# EAGLE design ir-sensorboard (EAGLE 5.11)
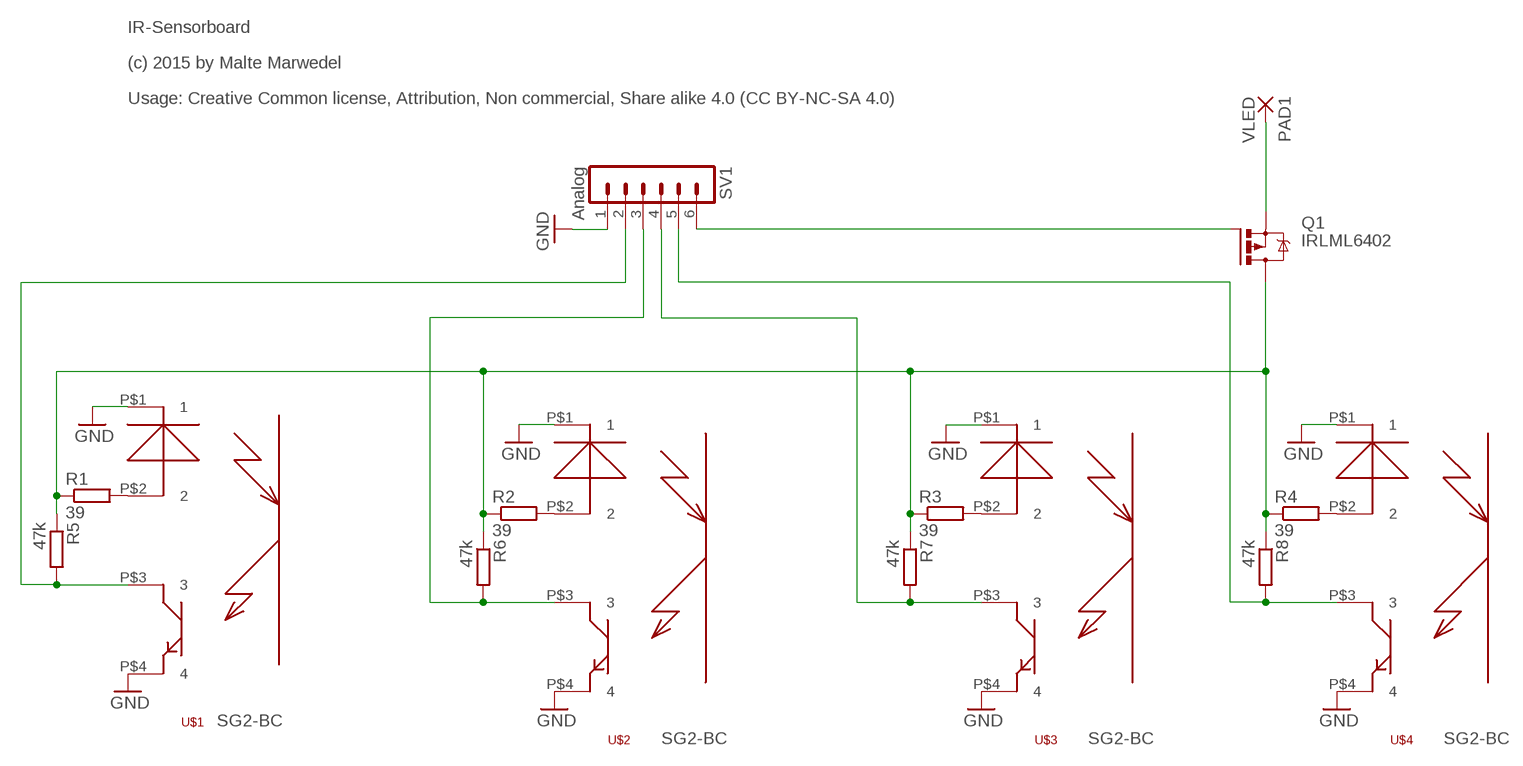
[diagram p0: schematic, sheet 1]

## Parts
PAD1  VLED  1,6/0,8  [1,6/0,8]
Q1  IRLML6402  IRLML5203  [MICRO3]
R1  39  R-EU_R0805  [R0805]
R2  39  R-EU_R0805  [R0805]
R3  39  R-EU_R0805  [R0805]
R4  39  R-EU_R0805  [R0805]
R5  47k  R-EU_R0805  [R0805]
R6  47k  R-EU_R0805  [R0805]
R7  47k  R-EU_R0805  [R0805]
R8  47k  R-EU_R0805  [R0805]
SV1  Analog  MA06-1  [MA06-1]
U$1  SG-2BC  [4PINSG]
U$2  SG-2BC  [4PINSG]
U$3  SG-2BC  [4PINSG]
U$4  SG-2BC  [4PINSG]

## Nets
GND: SV1.1 U$1.P$1 U$1.P$4 U$2.P$1 U$2.P$4 U$3.P$1 U$3.P$4 U$4.P$1 U$4.P$4
N$1: R1.2 U$1.P$2
N$2: R2.2 U$2.P$2
N$3: R3.2 U$3.P$2
N$4: R4.2 U$4.P$2
N$5: R5.2 SV1.2 U$1.P$3
N$6: R7.2 SV1.4 U$3.P$3
N$7: R8.2 SV1.5 U$4.P$3
N$8: R6.2 SV1.3 U$2.P$3
N$9: Q1.3(D) R1.1 R2.1 R3.1 R4.1 R5.1 R6.1 R7.1 R8.1
N$10: Q1.1(G) SV1.6
N$11: PAD1.1(P) Q1.2(S)

## Notes on the sheet
- IR-Sensorboard
- (c) 2015 by Malte Marwedel
- Usage: Creative Common license, Attribution, Non commercial, Share alike 4.0 (CC BY-NC-SA 4.0)
- SG2-BC
- SG2-BC | SG2-BC | SG2-BC

## Library data of the parts
PAD1 = wirepad:1,6/0,8: THROUGH-HOLE PAD
Q1 = transistor-power:IRLML5203: HEXFET P-Channel Power MOSFET
R1-R8 = rcl:R-EU_: RESISTOR, European symbol
SV1 = con-lstb:MA06-1: PIN HEADER; OC_FARNELL: unknown; OC_NEWARK: unknown
U$1-U$4 = maltes2_lib:SG-2BC: SG-2BC Best recognizion distance: 0.8mm Height: 3mm Input: IF=4mA, 1.2V Output: IF=4mA, VCE=2V Rise and fall time: 0.03ms

## Board
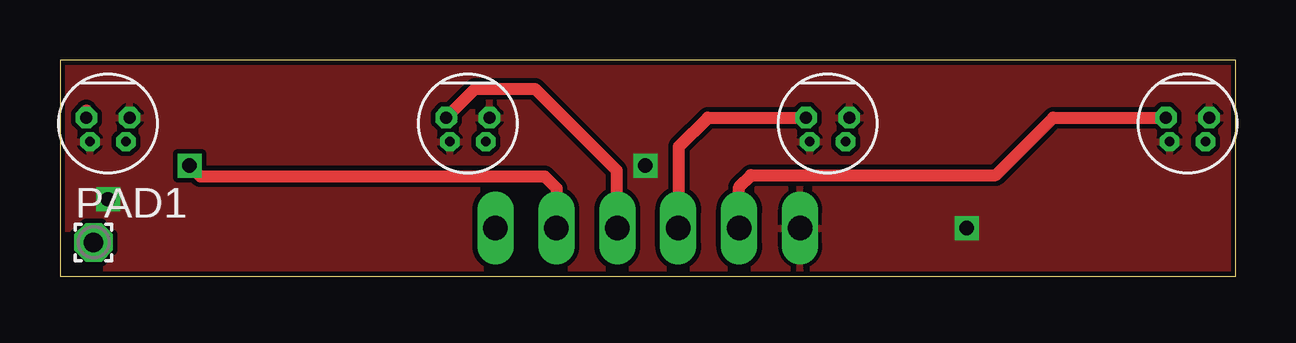
[diagram p1: board, top side]
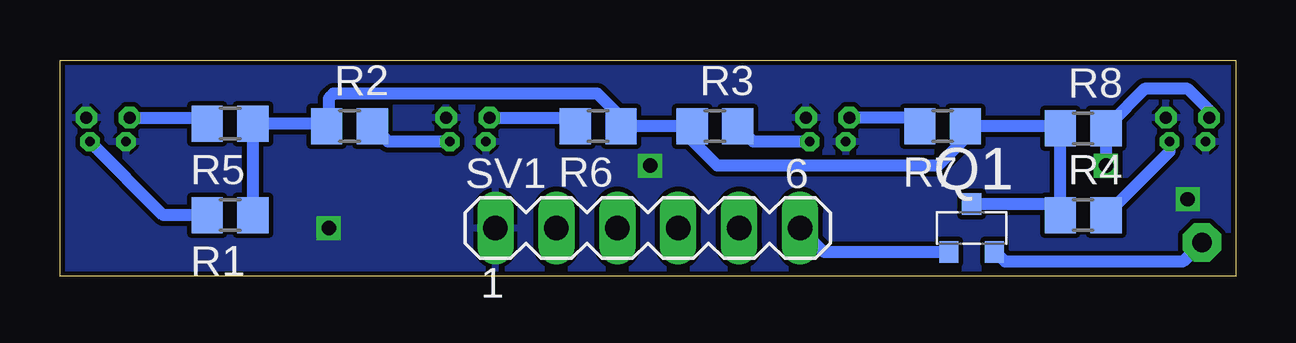
[diagram p2: board, bottom side, seen from below]

Size 49 x 9 mm. Coordinates in mm from the lower left corner, seen from the top.
Outline: 0,0 49,0 49,9 0,9 0,0
Copper layers (1*16): Top 0.035mm / dielectric 1.5mm / Bottom 0.035mm
Design rules "platinensammler_02": minimum track width 0.15mm, minimum drill 0.3mm, track to track 0.15mm, track to pad 0.15mm, pad to pad 0.15mm, via to via 0.15mm, smd to smd 0mil, copper to edge 0.2mm, drill to drill 0.2mm, minimum pad ring 0.2mm, minimum via ring 0.2mm, stop-mask expansion 4mil, vias tented up to drill 0.8mm, thermal gap 0.15mm

### Footprints (pad centres in the part's own frame; a part is rotated, then mirrored left to right if it is on the bottom)
1,6/0,8 = drill 0.813 pad 1.6 octagon: 1 0,0
MICRO3 = smd 0.8 x 0.9: 1 -0.95,-1; 2 0.95,-1; 3 0,1
R0805 = smd 1.3 x 1.5: 1 -0.95,0; 2 0.95,0
MA06-1 = drill 1.016 long: 1 -6.35,0; 2 -3.81,0; 3 -1.27,0; 4 1.27,0; 5 3.81,0; 6 6.35,0
4PINSG = drill 0.5 pad 0.85 octagon: P$1 0.9,0.25; P$3 -0.9,0.25 | drill 0.4 pad 0.75 octagon: P$2 0.75,-0.75; P$4 -0.75,-0.75

### Placement (x,y rotation side)
PAD1  1.4,1.4 0 top
Q1  11,2 0 bottom
R1  41.91,2.54 180 bottom
R2  36.93,6.25 0 bottom
R3  21.7,6.25 0 bottom
R4  6.35,2.54 0 bottom
R5  41.91,6.35 180 bottom
R6  26.57,6.25 180 bottom
R7  12.21,6.25 180 bottom
R8  6.35,6.15 0 bottom
SV1  24.5,2 0 bottom
U$1  47,6.35 0 top
U$2  32,6.35 0 top
U$3  17,6.35 0 top
U$4  2,6.35 0 top

### Tracks (layer width: path | path; a pad name or v marks a point on that pad's centre or on a via)
GND  (via drill 0.6)
  other vias: 2,3.2 37.8,2 24.4,4.6
  pour Bottom (isolate 0.2): 0,9 49,9 49,0 0,0
  pour Top (isolate 0.2): 0,9 49,9 49,0 0,0
N$1
  Bottom 0.5: R1.2 44.69,2.54 U$1.P$2
N$2
  Bottom 0.5: R2.2 35.33,5.6 U$2.P$2
N$3
  Bottom 0.5: R3.2 20.1,5.6 U$3.P$2
N$4
  Bottom 0.5: U$4.P$2 2.75,5.19 R4.2
N$5
  Top 0.5: SV1.2 28.31,3.71 28.8,4.2 39,4.2 41.4,6.6 U$1.P$3
  Bottom 0.5: U$1.P$3 43.11,6.6 R5.2
N$6
  Top 0.5: SV1.4 23.2,2.03 23.2,4.4 19.8,7.8 17.3,7.8 U$3.P$3
  Bottom 0.5: U$3.P$3 13.16,6.6 R7.2
N$7  (via drill 0.6)
  Top 0.5: SV1.5 20.7,3.65 20.2,4.15 5.85,4.15 v5.4,4.6 | U$4.P$3 1.1,6.9
  Bottom 0.5: U$4.P$3 1.1,6.9 2,7.8 3.8,7.8 5.25,6.35 R8.2 v5.4,4.6
N$8
  Top 0.5: SV1.3 25.8,2.03 25.8,5.4 27,6.6 U$2.P$3
  Bottom 0.5: U$2.P$3 27.87,6.6 R6.2
N$9
  Bottom 0.5: R4.1 7.3,3 | R1.1 R5.1 37.98,6.35 R2.1 37.8,6.33 37.8,7.4 37.6,7.6 26.6,7.6 25.62,6.62 R6.1 R3.1 22.6,6.25 22.6,5.6 21.6,4.6 12.4,4.6 11.26,5.74 R7.1 7.4,6.25 R8.1 7.3,3 | 7.3,3 Q1.3
N$10
  Bottom 0.5: SV1.6 17.15,1 Q1.1
N$11
  Bottom 0.5: Q1.2 10,1 9.6,0.6 2.2,0.6 PAD1.1